# EAGLE design raspberry_media_center (EAGLE 9.0.1)
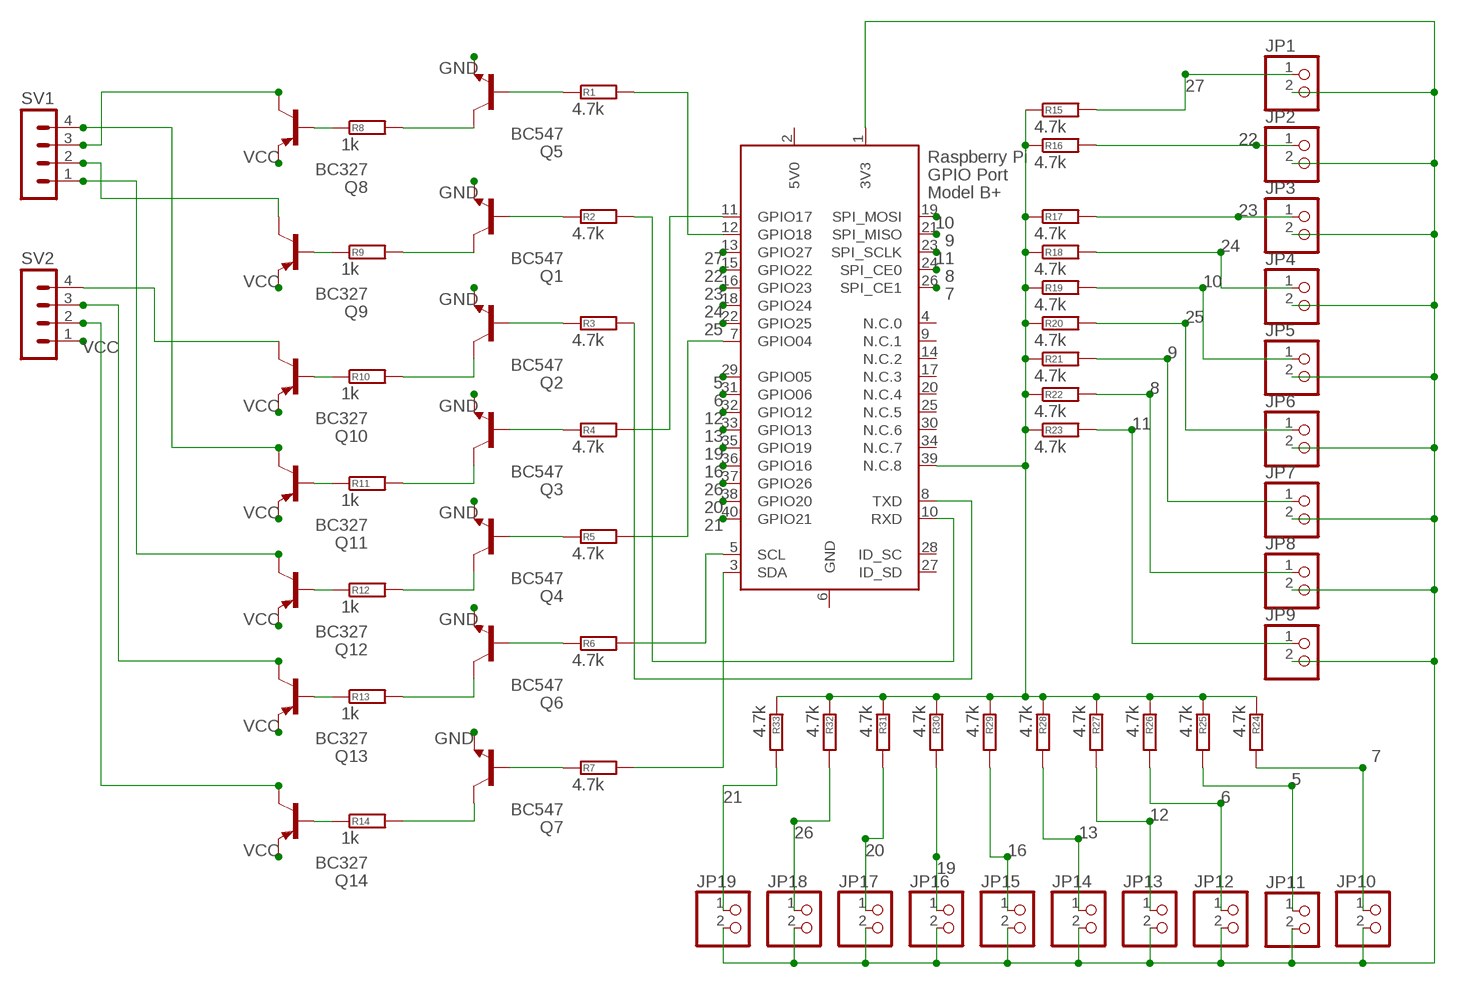
[diagram p0: schematic, sheet 1]

## Parts
JP1  PINHD-1X2  [1X02]
JP2  PINHD-1X2  [1X02]
JP3  PINHD-1X2  [1X02]
JP4  PINHD-1X2  [1X02]
JP5  PINHD-1X2  [1X02]
JP6  PINHD-1X2  [1X02]
JP7  PINHD-1X2  [1X02]
JP8  PINHD-1X2  [1X02]
JP9  PINHD-1X2  [1X02]
JP10  PINHD-1X2  [1X02]
JP11  PINHD-1X2  [1X02]
JP12  PINHD-1X2  [1X02]
JP13  PINHD-1X2  [1X02]
JP14  PINHD-1X2  [1X02]
JP15  PINHD-1X2  [1X02]
JP16  PINHD-1X2  [1X02]
JP17  PINHD-1X2  [1X02]
JP18  PINHD-1X2  [1X02]
JP19  PINHD-1X2  [1X02]
Q1  BC547  [TO92]
Q2  BC547  [TO92]
Q3  BC547  [TO92]
Q4  BC547  [TO92]
Q5  BC547  [TO92]
Q6  BC547  [TO92]
Q7  BC547  [TO92]
Q8  BC327  [TO92-EBC]
Q9  BC327  [TO92-EBC]
Q10  BC327  [TO92-EBC]
Q11  BC327  [TO92-EBC]
Q12  BC327  [TO92-EBC]
Q13  BC327  [TO92-EBC]
Q14  BC327  [TO92-EBC]
R1  4.7k  R-EU_0204/7  [0204/7]
R2  4.7k  R-EU_0204/7  [0204/7]
R3  4.7k  R-EU_0204/7  [0204/7]
R4  4.7k  R-EU_0204/7  [0204/7]
R5  4.7k  R-EU_0204/7  [0204/7]
R6  4.7k  R-EU_0204/7  [0204/7]
R7  4.7k  R-EU_0204/7  [0204/7]
R8  1k  R-EU_0204/7  [0204/7]
R9  1k  R-EU_0204/7  [0204/7]
R10  1k  R-EU_0204/7  [0204/7]
R11  1k  R-EU_0204/7  [0204/7]
R12  1k  R-EU_0204/7  [0204/7]
R13  1k  R-EU_0204/7  [0204/7]
R14  1k  R-EU_0204/7  [0204/7]
R15  4.7k  R-EU_0207/15  [0207/15]
R16  4.7k  R-EU_0207/15  [0207/15]
R17  4.7k  R-EU_0207/15  [0207/15]
R18  4.7k  R-EU_0207/15  [0207/15]
R19  4.7k  R-EU_0207/15  [0207/15]
R20  4.7k  R-EU_0207/15  [0207/15]
R21  4.7k  R-EU_0207/15  [0207/15]
R22  4.7k  R-EU_0207/15  [0207/15]
R23  4.7k  R-EU_0207/15  [0207/15]
R24  4.7k  R-EU_0207/15  [0207/15]
R25  4.7k  R-EU_0207/15  [0207/15]
R26  4.7k  R-EU_0207/15  [0207/15]
R27  4.7k  R-EU_0207/15  [0207/15]
R28  4.7k  R-EU_0207/15  [0207/15]
R29  4.7k  R-EU_0207/15  [0207/15]
R30  4.7k  R-EU_0207/15  [0207/15]
R31  4.7k  R-EU_0207/15  [0207/15]
R32  4.7k  R-EU_0207/15  [0207/15]
R33  4.7k  R-EU_0207/15  [0207/15]
SV1  MA04-1  [MA04-1]
SV2  MA04-1  [MA04-1]
X1  RASPI_BOARD_B+_E0  [RASPI_BOARD_B+_EDGES_0DRILL]

## Nets
5: JP11.1 R25.2 X1.29(GPIO05)
6: JP12.1 R26.2 X1.31(GPIO06)
7: JP10.1 R24.2 X1.26(SPI_CE1)
8: JP8.1 R22.2 X1.24(SPI_CE0)
9: JP7.1 R21.2 X1.21(SPI_MISO)
10: JP5.1 R19.2 X1.19(SPI_MOSI)
11: JP9.1 R23.2 X1.23(SPI_SCLK)
12: JP13.1 R27.2 X1.32(GPIO12)
13: JP14.1 R28.2 X1.33(GPIO13)
16: JP15.1 R29.2 X1.36(GPIO16)
19: JP16.1 R30.2 X1.35(GPIO19)
20: JP17.1 R31.2 X1.38(GPIO20)
21: JP19.1 R33.2 X1.40(GPIO21)
22: JP2.1 R16.2 X1.15(GPIO22)
23: JP3.1 R17.2 X1.16(GPIO23)
24: JP4.1 R18.2 X1.18(GPIO24)
25: JP6.1 R20.2 X1.22(GPIO25)
26: JP18.1 R32.2 X1.37(GPIO26)
27: JP1.1 R15.2 X1.13(GPIO27)
GND: Q1.1(E) Q2.1(E) Q3.1(E) Q4.1(E) Q5.1(E) Q6.1(E) Q7.1(E)
N$1: R7.2 X1.3(SDA)
N$2: R6.2 X1.5(SCL)
N$3: R5.2 X1.7(GPIO04)
N$4: R4.2 X1.11(GPIO17)
N$5: R3.2 X1.8(TXD)
N$6: R2.2 X1.10(RXD)
N$7: R1.2 X1.12(GPIO18)
N$8: Q5.2(B) R1.1
N$9: Q1.2(B) R2.1
N$10: Q2.2(B) R3.1
N$11: Q3.2(B) R4.1
N$12: Q4.2(B) R5.1
N$13: Q6.2(B) R6.1
N$14: Q7.2(B) R7.1
N$15: Q1.3(C) R9.2
N$16: Q5.3(C) R8.2
N$17: Q6.3(C) R13.2
N$18: Q4.3(C) R12.2
N$19: Q3.3(C) R11.2
N$20: Q2.3(C) R10.2
N$21: Q7.3(C) R14.2
N$22: Q8.B R8.1
N$23: Q9.B R9.1
N$24: Q10.B R10.1
N$25: Q11.B R11.1
N$26: Q12.B R12.1
N$27: Q13.B R13.1
N$28: Q14.B R14.1
N$31: R15.1 R16.1 R17.1 R18.1 R19.1 R20.1 R21.1 R22.1 R23.1 R24.1 R25.1 R26.1 R27.1 R28.1 R29.1 R30.1 R31.1 R32.1 R33.1 X1.39(N.C.8)
N$38: JP1.2 JP2.2 JP3.2 JP4.2 JP5.2 JP6.2 JP7.2 JP8.2 JP9.2 JP10.2 JP11.2 JP12.2 JP13.2 JP14.2 JP15.2 JP16.2 JP17.2 JP18.2 JP19.2 X1.1(3V3)
N$48: Q14.C SV2.2
N$49: Q13.C SV2.3
N$50: Q12.C SV1.1
N$51: Q11.C SV1.4
N$52: Q10.C SV2.4
N$54: Q8.C SV1.3
N$57: Q9.C SV1.2
VCC: Q8.E Q9.E Q10.E Q11.E Q12.E Q13.E Q14.E SV2.1
Unconnected: X1.4(N.C.0) X1.9(N.C.1) X1.14(N.C.2) X1.17(N.C.3) X1.20(N.C.4) X1.25(N.C.5) X1.27(ID_SD) X1.28(ID_SC) X1.30(N.C.6) X1.34(N.C.7)

## Power pins joined to a net without a drawn wire
5V0: X1.2(5V0)
GND: X1.6(GND)

## Library data of the parts
JP1-JP19 = dd_goldpin:PINHD-1X2: PIN HEADER
Q1-Q7 = dd_transistor:BC547: NPN TRANSISTOR
Q8-Q14 = dd_transistor:BC327*: PNP Transistror
R1-R33 = dd_resistor:R-EU_: RESISTOR, European symbol
SV1 SV2 = dd_goldpin:MA04-1: PIN HEADER; OC_FARNELL: unknown; OC_NEWARK: unknown
X1 = dd_raspberry:RASPI_BOARD_B+: Raspberry Pi GPIO connector with markings for the outer dimensions of the Raspberry Pi board model B+ with different sets of drill holes or mounting pads

## Board
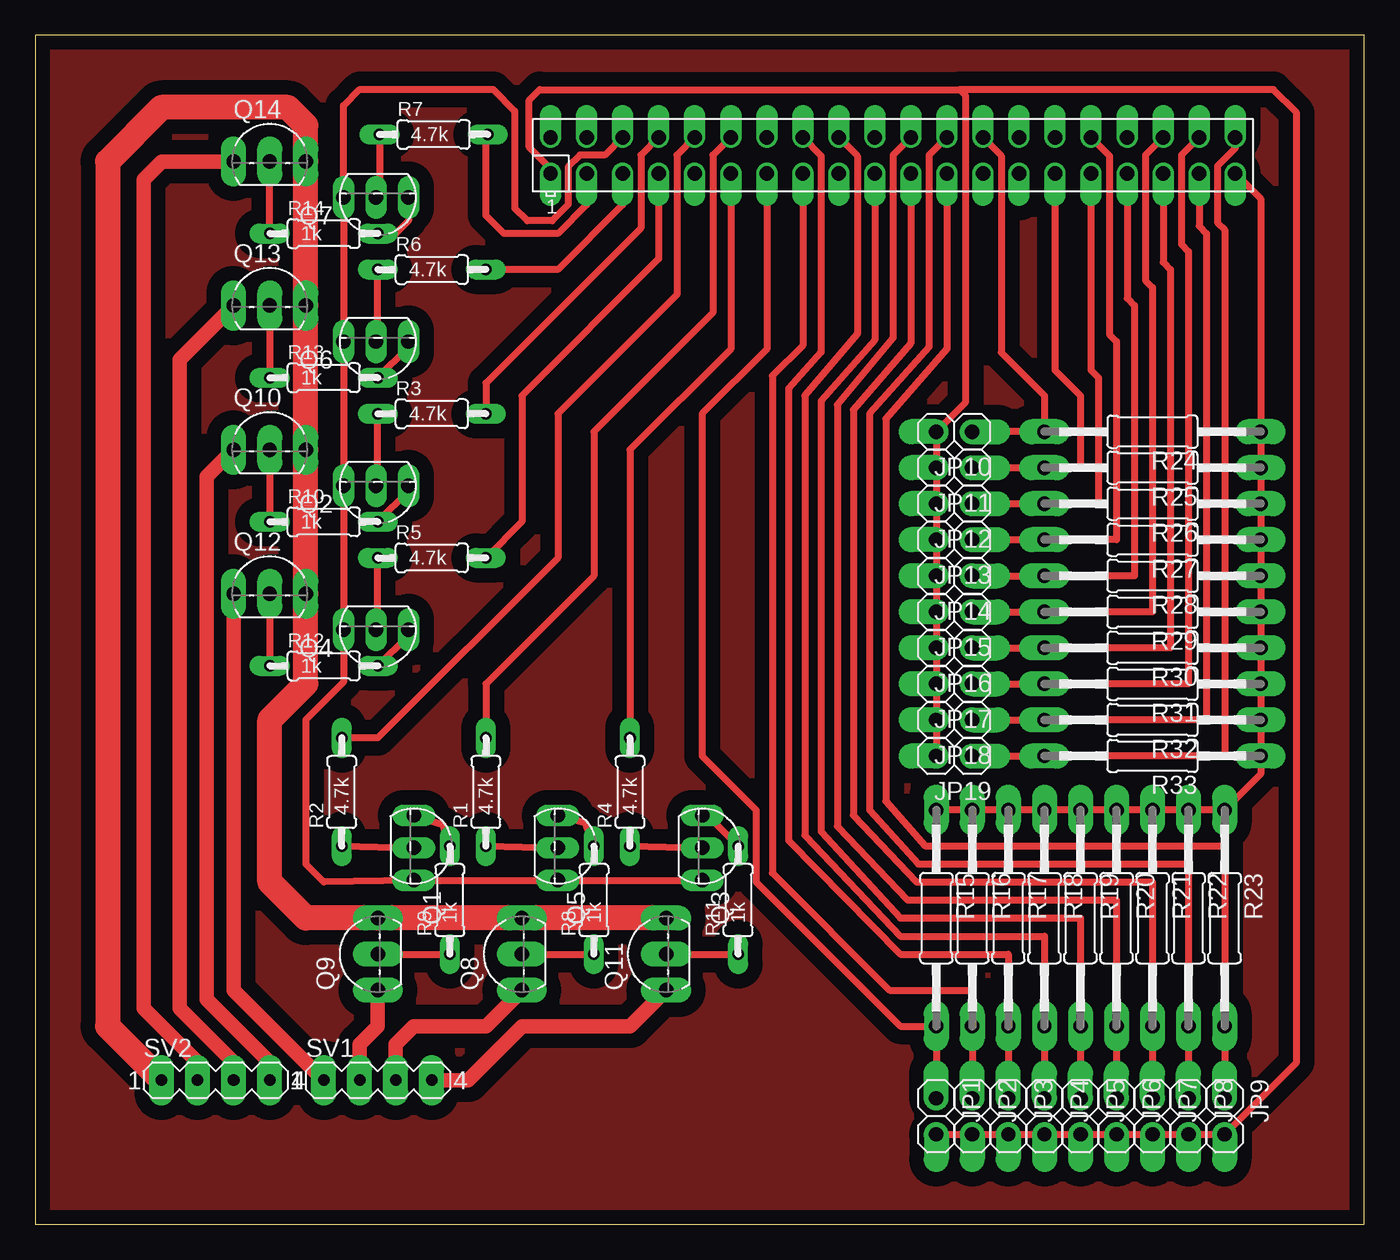
[diagram p1: board, top side]
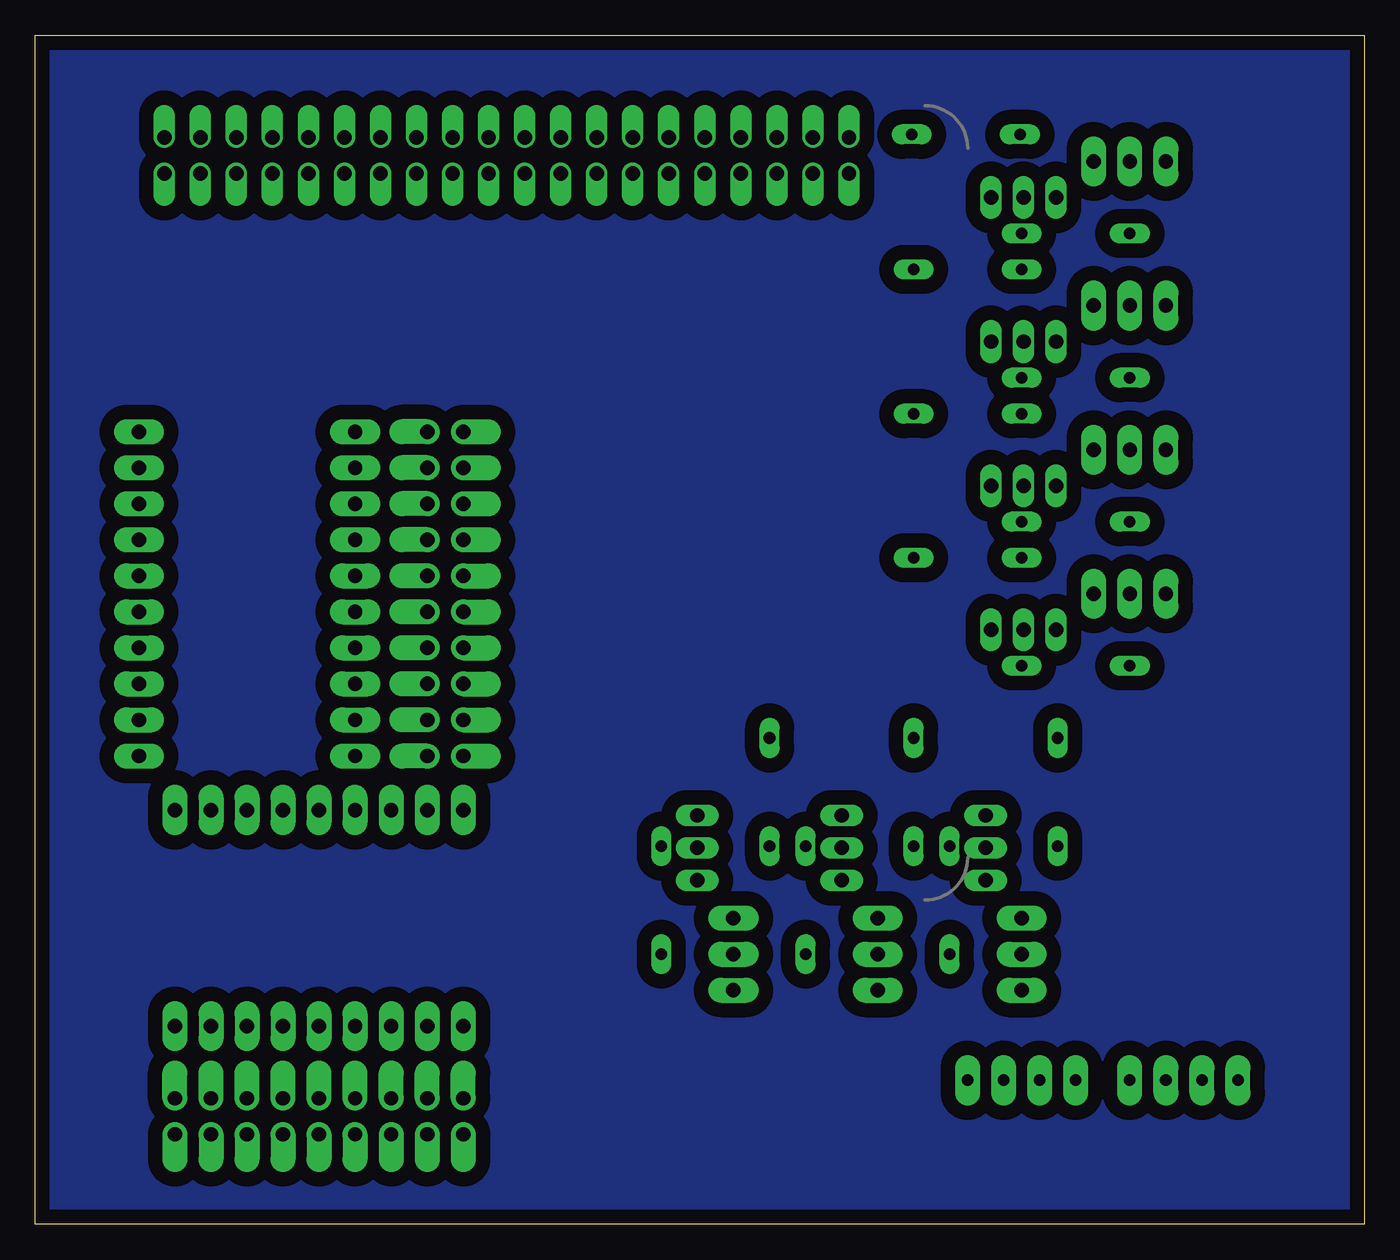
[diagram p2: board, bottom side, seen from below]

Size 93.65 x 83.81 mm. Coordinates in mm from the lower left corner, seen from the top.
Outline: 0,0 93.65,0 93.65,83.81 0,83.81 0,0
Copper layers (1*16): Top 0.035mm / dielectric 1.5mm / Bottom 0.035mm
Design rules "default": minimum track width 6mil, minimum drill 0.35mm, track to track 6mil, track to pad 6mil, pad to pad 6mil, via to via 6mil, smd to smd 6mil, copper to edge 40mil, drill to drill 6mil, minimum pad ring 10mil, minimum via ring 8mil, stop-mask expansion 4mil, vias tented up to drill 0mil, thermal gap 10mil

### Footprints (pad centres in the part's own frame; a part is rotated, then mirrored left to right if it is on the bottom)
1X02 = drill 1.016 pad 1.778 offset: 1 -1.27,0; 2 1.27,0
TO92 = drill 1.016 long: 1 2.413,0; 2 0.127,0; 3 -2.159,0
TO92-EBC = drill 1.016 pad 1.778 long: B 0,-1.27; C -2.54,-1.27; E 2.54,-1.27
0204/7 = drill 0.813 pad 1.422 long: 1 -3.81,0; 2 3.81,0
0207/15 = drill 1.016 pad 1.778 long: 1 -7.62,0; 2 7.62,0
MA04-1 = drill 0.813 pad 1.778 long: 1 -3.81,0; 2 -1.27,0; 3 1.27,0; 4 3.81,0
RASPI_BOARD_B+_EDGES_0DRILL = drill 1.016 pad 1.422 offset: 1 8.37,51.23; 2 8.37,53.77; 3 10.91,51.23; 4 10.91,53.77; 5 13.45,51.23; 6 13.45,53.77; 7 15.99,51.23; 8 15.99,53.77; 9 18.53,51.23; 10 18.53,53.77; 11 21.07,51.23; 12 21.07,53.77; 13 23.61,51.23; 14 23.61,53.77; 15 26.15,51.23; 16 26.15,53.77; 17 28.69,51.23; 18 28.69,53.77; 19 31.23,51.23; 20 31.23,53.77; 21 33.77,51.23; 22 33.77,53.77; 23 36.31,51.23; 24 36.31,53.77; 25 38.85,51.23; 26 38.85,53.77; 27 41.39,51.23; 28 41.39,53.77; 29 43.93,51.23; 30 43.93,53.77; 31 46.47,51.23; 32 46.47,53.77; 33 49.01,51.23; 34 49.01,53.77; 35 51.55,51.23; 36 51.55,53.77; 37 54.09,51.23; 38 54.09,53.77; 39 56.63,51.23; 40 56.63,53.77

### Placement (x,y rotation side)
JP1  63.5,7.62 270 top
JP2  66.04,7.62 270 top
JP3  68.58,7.62 270 top
JP4  71.12,7.62 270 top
JP5  73.66,7.62 270 top
JP6  76.2,7.62 270 top
JP7  78.74,7.62 270 top
JP8  81.28,7.62 270 top
JP9  83.82,7.62 270 top
JP10  64.77,55.88 180 top
JP11  64.77,53.34 180 top
JP12  64.77,50.8 180 top
JP13  64.77,48.26 180 top
JP14  64.77,45.72 180 top
JP15  64.77,43.18 180 top
JP16  64.77,40.64 180 top
JP17  64.77,38.1 180 top
JP18  64.77,35.56 180 top
JP19  64.77,33.02 180 top
Q1  26.67,26.67 270 top
Q2  24.13,52.07 180 top
Q3  46.99,26.67 270 top
Q4  24.13,41.91 180 top
Q5  36.83,26.67 270 top
Q6  24.13,62.23 180 top
Q7  24.13,72.39 180 top
Q8  33.02,19.05 90 top
Q9  22.86,19.05 90 top
Q10  16.51,55.88 0 top
Q11  43.18,19.05 90 top
Q12  16.51,45.72 0 top
Q13  16.51,66.04 0 top
Q14  16.51,76.2 0 top
R1  31.75,30.48 90 top
R2  21.59,30.48 90 top
R3  27.94,57.15 0 top
R4  41.91,30.48 90 top
R5  27.94,46.99 0 top
R6  27.94,67.31 0 top
R7  28.07,76.83 0 top
R8  39.37,22.86 90 top
R9  29.21,22.86 90 top
R10  20.32,49.53 0 top
R11  49.53,22.86 90 top
R12  20.32,39.37 0 top
R13  20.32,59.69 0 top
R14  20.32,69.85 0 top
R15  63.5,21.59 270 top
R16  66.04,21.59 270 top
R17  68.58,21.59 270 top
R18  71.12,21.59 270 top
R19  73.66,21.59 270 top
R20  76.2,21.59 270 top
R21  78.74,21.59 270 top
R22  81.28,21.59 270 top
R23  83.82,21.59 270 top
R24  78.74,55.88 180 top
R25  78.74,53.34 180 top
R26  78.74,50.8 180 top
R27  78.74,48.26 180 top
R28  78.74,45.72 180 top
R29  78.74,43.18 180 top
R30  78.74,40.64 180 top
R31  78.74,38.1 180 top
R32  78.74,35.56 180 top
R33  78.74,33.02 180 top
SV1  24.13,10.16 0 top
SV2  12.7,10.16 0 top
X1  27.94,22.86 0 top

### Tracks (layer width: path | path; a pad name or v marks a point on that pad's centre or on a via)
5
  Top 0.508: X1.29 71.87,60.21 73.66,58.42 73.66,53.34 R25.2 JP11.1
6
  Top 0.508: X1.31 74.41,60.21 74.93,59.69 74.93,50.8 R26.2 JP12.1
7
  Top 0.508: X1.26 68.08,75.33 68.08,61.46 71.12,58.42 R24.2 JP10.1
8
  Top 0.508: JP8.1 R22.2 81.28,25.4 62.23,25.4 58.8,29.21 58.8,57.15 62.99,61.85 62.99,75.37 X1.24
9
  Top 0.508: JP7.1 R21.2 78.74,24.13 62.1,24.13 57.66,28.83 57.66,57.4 61.71,62.09 X1.21
10
  Top 0.508: X1.19 59.17,62.35 55.37,58.04 55.37,27.69 60.96,21.59 73.66,21.59 R19.2 JP5.1
11
  Top 0.508: JP9.1 R23.2 83.82,26.67 62.74,26.67 59.94,29.84 59.94,56.77 64.25,61.71 X1.23
12
  Top 0.508: X1.32 75.7,75.33 75.7,62.73 76.2,62.23 76.2,48.26 R27.2 JP13.1
13
  Top 0.508: X1.33 76.95,65.29 77.47,64.77 77.47,45.72 R28.2 JP14.1
16
  Top 0.508: X1.36 78.25,75.38 78.25,66.53 78.74,66.04 78.74,43.18 R29.2 JP15.1
19
  Top 0.508: X1.35 79.49,67.83 80.01,67.31 80.01,40.64 R30.2 JP16.1
20
  Top 0.508: X1.38 80.77,75.37 80.77,69.09 81.28,68.58 81.28,38.1 R31.2 JP17.1
21
  Top 0.508: X1.40 84.57,75.85 83.33,74.61 83.33,70.63 83.82,70.13 83.82,33.02 R33.2 JP19.1
22
  Top 0.508: X1.15 54.09,61.96 51.94,59.82 51.94,24.77 60.2,16.51 66.04,16.51 R16.2 JP2.1
23
  Top 0.508: JP3.1 R17.2 68.58,19.05 60.96,19.05 53.09,27.05 53.09,58.93 55.39,61.48 55.39,75.33 X1.16
24
  Top 0.508: JP4.1 R18.2 71.12,20.32 60.96,20.32 54.23,27.43 54.23,58.42 57.92,62.75 57.92,75.33 X1.18
25
  Top 0.508: JP6.1 R20.2 76.2,22.86 61.47,22.86 56.52,28.07 56.52,57.79 60.45,62.48 60.45,75.37 X1.22
26
  Top 0.508: X1.37 82.03,70.37 82.55,69.85 82.55,35.56 R32.2 JP18.1
27
  Top 0.508: JP1.1 R15.2 60.96,13.97 50.8,24.13 50.8,29.21 46.99,33.02 46.99,57.15 51.55,61.71 X1.13
GND
  Top 0.508: X1.6 40.14,75.38 38.38,75.38 37.55,74.55 37.55,71.9 36.45,70.79 36.45,70.74 34.67,70.74 33.78,71.63 33.78,78.49 32.26,80.01 22.86,80.01 21.72,78.87 Q7.1 Q6.1 Q2.1 Q4.1 21.72,38.23 19.05,35.56 19.05,25.4 20.32,24.13 Q1.1 Q5.1 Q3.1
N$1
  Top 0.508: X1.3 38.85,71.87 36.83,69.85 33.02,69.85 31.75,71.12 31.75,76.71 R7.2
N$2
  Top 0.508: X1.5 41.39,71.87 36.83,67.31 R6.2
N$3
  Top 0.508: X1.7 43.93,68.06 34.29,58.42 34.29,49.53 R5.2
N$4
  Top 0.508: X1.11 49.01,61.71 41.91,54.61 R4.2
N$5
  Top 0.508: X1.8 42.67,75.37 42.67,70.23 31.75,59.31 R3.2
N$6
  Top 0.508: X1.10 45.21,75.37 45.21,65.53 36.83,57.15 36.83,46.99 24.13,34.29 R2.2
N$7
  Top 0.508: X1.12 47.75,75.37 47.75,64.26 39.37,55.88 39.37,45.72 31.75,38.1 R1.2
N$8
  Top 0.508: R1.1 Q5.2
N$9
  Top 0.508: R2.1 Q1.2
N$10
  Top 0.508: Q2.2 24.13,52.2 R3.1
N$11
  Top 0.508: R4.1 Q3.2
N$12
  Top 0.508: Q4.2 24.13,42.04 R5.1
N$13
  Top 0.508: Q6.2 24.13,62.36 R6.1
N$14
  Top 0.508: R7.1 24.26,72.64 Q7.2
N$15
  Top 0.508: Q1.3 28.7,28.19 R9.2
N$16
  Top 0.508: Q5.3 38.73,28.32 R8.2
N$17
  Top 0.508: R13.2 26.29,61.85 Q6.3
N$18
  Top 0.508: R12.2 26.29,41.53 Q4.3
N$19
  Top 0.508: R11.2 47.37,28.83 Q3.3
N$20
  Top 0.508: Q2.3 26.29,51.69 R10.2
N$21
  Top 0.508: Q7.3 26.29,70.74 25.4,69.85 R14.2
N$22
  Top 0.508: Q8.B R8.1
N$23
  Top 0.508: Q9.B R9.1
N$24
  Top 0.508: Q10.B R10.1
N$25
  Top 0.508: Q11.B R11.1
N$26
  Top 0.508: Q12.B R12.1
N$27
  Top 0.508: Q13.B R13.1
N$28
  Top 0.508: R14.1 Q14.B
N$29
  pour Top (isolate 1.016): 0,83.82 93.98,83.82 93.98,0 0,0
N$30
  pour Bottom (isolate 1.016): 0,83.82 93.98,83.82 93.98,0 0,0
N$31
  Top 0.508: R15.1 R16.1 R17.1 R18.1 R19.1 R20.1 R21.1 R22.1 R23.1 86.36,31.75 R33.1 R32.1 R31.1 R30.1 R29.1 R28.1 R27.1 R26.1 R25.1 R24.1 86.36,72.3 X1.39
N$38
  Top 0.508: X1.1 36.31,74.43 34.8,75.95 34.8,79.25 35.55,80 65.16,80 | 65.16,80 65.55,79.62 65.55,57.93 JP10.2 JP12.2 | JP12.2 JP14.2 | JP14.2 JP16.2 | JP16.2 JP18.2 | JP18.2 JP19.2 | JP1.2 JP3.2 | JP3.2 JP5.2 | JP5.2 JP7.2 | JP7.2 JP9.2 | JP9.2 88.9,11.43 88.9,78.36 87.26,80 65.16,80 | JP17.2 JP18.2 | JP15.2 JP16.2 | JP13.2 JP14.2 | JP11.2 JP12.2 | JP2.2 JP3.2 | JP4.2 JP5.2 | JP6.2 JP7.2 | JP8.2 JP9.2
N$48
  Top 1.016: Q14.C 8.89,74.93 7.62,73.66 7.62,15.24 11.43,11.43 SV2.2
N$49
  Top 1.016: Q13.C 10.16,60.96 10.16,15.24 13.97,11.43 SV2.3
N$50
  Top 1.016: SV1.1 13.97,16.51 Q12.C
N$51
  Top 1.016: Q11.C 41.91,13.97 34.29,13.97 30.48,10.16 SV1.4
N$52
  Top 1.016: SV2.4 16.51,11.43 12.06,15.88 12.06,52.71 Q10.C
N$54
  Top 1.016: Q8.C 31.75,13.97 26.67,13.97 25.4,12.7 SV1.3
N$57
  Top 1.016: Q9.C 24.13,13.97 22.86,12.7 SV1.2
VCC
  Top 1.778: Q11.E Q8.E Q9.E 19.05,21.59 16.51,24.13 16.51,35.56 19.05,38.1 Q12.E Q10.E Q13.E Q14.E 19.05,77.47 17.78,78.74 8.89,78.74 5.08,74.93 5.08,13.97 SV2.1